# Altium schematic sheet WR_LINK.SchDoc
size A4
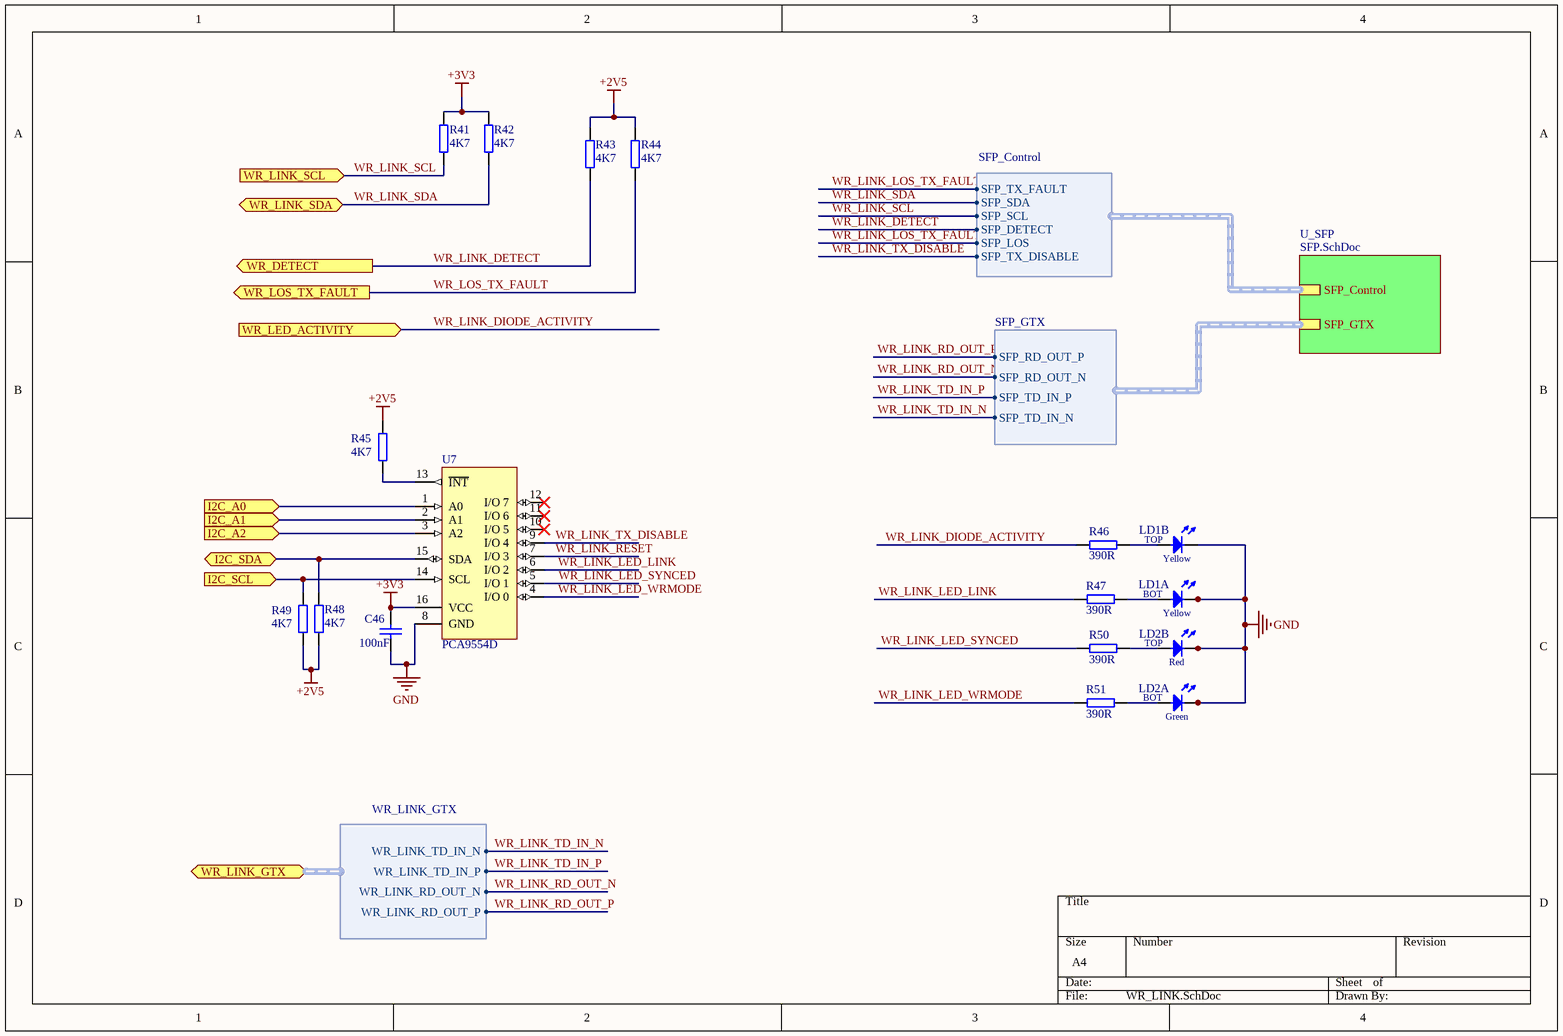
[diagram p0: WR_LINK.SchDoc]

## Parts
C46  100nF  [CC1608-0603]
LD1  Yellow/Yellow  [LED_DIALIGHT_571-0133-100F]  (value not drawn)  (parts A,B of 2)
LD2  Green/Yellow  [LED_DIALIGHT_571-0132-100F]  (value not drawn)  (parts A,B of 2)
R41  4K7  [0402]
R42  4K7  [0402]
R43  4K7  [0402]
R44  4K7  [0402]
R45  4K7  [0603]
R46  390R  [0603]
R47  390R  [0603]
R48  4K7  [0603]
R49  4K7  [0603]
R50  390R  [0603]
R51  390R  [0603]
U7  PCA9554D  [SOP65P640X110-20N]

## Sub-sheets
U_SFP = SFP.SchDoc: SFP_Control (harness SFP_Control), SFP_GTX (harness SFP_GTX)

## Ports
I2C_A0 (in), I2C_A1 (in), I2C_A2 (in), I2C_SCL (in), I2C_SDA (bidir), WR_DETECT (out), WR_LED_ACTIVITY (in), WR_LINK_GTX (harness WR_LINK_GTX), WR_LINK_SCL (in), WR_LINK_SDA (bidir), WR_LOS_TX_FAULT (out)

## Harnesses
WR_LINK_GTX: WR_LINK_TD_IN_N, WR_LINK_TD_IN_P, WR_LINK_RD_OUT_N, WR_LINK_RD_OUT_P
SFP_GTX: SFP_TD_IN_N, SFP_TD_IN_P, SFP_RD_OUT_N, SFP_RD_OUT_P
SFP_Control: SFP_DETECT, SFP_LOS, SFP_SCL, SFP_SDA, SFP_TX_FAULT, SFP_TX_DISABLE

## Nets
+2V5: R43.2 R44.2 R45.2 R48.2 R49.1
+3V3: C46.1 R41.2 R42.2 U7.16(VCC)
GND: C46.2 LD1.1(C) LD1.3(C) LD2.1(C) LD2.3(C) U7.8(GND)
I2C_A0: U7.1(A0) ; port I2C_A0
I2C_A1: U7.2(A1) ; port I2C_A1
I2C_A2: U7.3(A2) ; port I2C_A2
I2C_SCL: R49.2 U7.14(SCL) ; port I2C_SCL
I2C_SDA: R48.1 U7.15(SDA) ; port I2C_SDA
WR_LINK_DETECT: R43.1 ; port WR_DETECT, sheet U_SFP/SFP_Control.SFP_DETECT
WR_LINK_DIODE_ACTIVITY: R46.2 ; port WR_LED_ACTIVITY
WR_LINK_LED_LINK: R47.2 U7.6(I/O_2)
WR_LINK_LED_SYNCED: R50.2 U7.5(I/O_1)
WR_LINK_LED_WRMODE: R51.2 U7.4(I/O_0)
WR_LINK_LOS_TX_FAULT: sheet U_SFP/SFP_Control.SFP_LOS, sheet U_SFP/SFP_Control.SFP_TX_FAULT
WR_LINK_RD_OUT_N: port WR_LINK_GTX.WR_LINK_RD_OUT_N, sheet U_SFP/SFP_GTX.SFP_RD_OUT_N
WR_LINK_RD_OUT_P: port WR_LINK_GTX.WR_LINK_RD_OUT_P, sheet U_SFP/SFP_GTX.SFP_RD_OUT_P
WR_LINK_RESET: U7.7(I/O_3)
WR_LINK_SCL: R41.1 ; port WR_LINK_SCL, sheet U_SFP/SFP_Control.SFP_SCL
WR_LINK_SDA: R42.1 ; port WR_LINK_SDA, sheet U_SFP/SFP_Control.SFP_SDA
WR_LINK_TD_IN_N: port WR_LINK_GTX.WR_LINK_TD_IN_N, sheet U_SFP/SFP_GTX.SFP_TD_IN_N
WR_LINK_TD_IN_P: port WR_LINK_GTX.WR_LINK_TD_IN_P, sheet U_SFP/SFP_GTX.SFP_TD_IN_P
WR_LINK_TX_DISABLE: U7.9(I/O_4) ; sheet U_SFP/SFP_Control.SFP_TX_DISABLE
WR_LOS_TX_FAULT: R44.1 ; port WR_LOS_TX_FAULT
NetLD1_2: LD1.2(A) R47.1
NetLD1_4: LD1.4(A) R46.1
NetLD2_2: LD2.2(A) R51.1
NetLD2_4: LD2.4(A) R50.1
NetR45_1: R45.1 U7.13(~{INT})

Not connected (* = marked no-connect by the designer): U7 10(I/O_5)* 11(I/O_6)* 12(I/O_7)*

## Notes on the sheet
- (in symbol LED_DIALIGHT_571-0132-100F, part A) BOT; Green
- (in symbol LED_DIALIGHT_571-0132-100F, part B) TOP; Red
- (in symbol LED_DIALIGHT_571-0133-100F, part A) BOT; Yellow
- (in symbol LED_DIALIGHT_571-0133-100F, part B) TOP; Yellow

## Library data of the parts
C46 = CC0603_100NF_16V_10%_X7R: Capacitor; Manufacturer1: AVX; Manufacturer1 PN: 0603YC104KAT2A; TC: X7R; Tolerance: ±10%; Voltage: 16V; Published: 8-Jun-2000; LatestRevisionDate: 17-Jul-2002; LatestRevisionNote: Re-released for DXP Platform.; PackageReference: RAD-0.3; Publisher: Altium Limited; Distributor1: Digikey; Distributor1 PN: 478-1239-1-ND; Case: 0603; Value: 100nF
LD1 = LED_DIALIGHT_571-0133-100F: LED x2 Yellow 1C2A-BOT_3C4A-TOP; Part Description: Dual 2mm Yellow LEDs CBI® Circuit Board Indicator (With positioning pins); Table: LEDs & Displays; Part Number: LED_DIALIGHT_571-0133-100F; Component Kind: Standard; Component Type: Standard; Color: Yellow/Yellow; PackageDescription: 2x 2mm Yellow LED PCB Edge Mounting (With positioning pins) DIALIGHT 571 Serie; Manufacturer: DIALIGHT; Manufacturer Part Number: 571-0133-100F; Pin Count: 4; Mounted: Yes; Socket: No; SMD: No; ComponentHeight: 8.6mm; HelpURL: \\cern.ch\dfs\Applications\Altium\Datasheets\LED_DIALIGHT_571-0133-100F.pdf; Author: CERN DEM JLC; CreateDate: 05/11/2009; LatestRevisionDate: 17/03/2010
LD2 = LED_DIALIGHT_571-0132-100F: 2x LED  Botom Green, Top Yellow; Part Description: Dual 2mm  LEDs, Yellow Top,Green Bot, CBI® Circuit Board Indicator (With positioning pins); Table: LEDs & Displays; Part Number: LED_DIALIGHT_571-0132-100F; Component Kind: Standard; Component Type: Standard; Color: Green/Yellow; PackageDescription: 2x 2mm LED (Top: Yellow, Bot: Green) PCB Edge Mounting (With positioning pins) DIALIGHT 571 Serie; Manufacturer: DIALIGHT; Manufacturer Part Number: 571-0132-100F; Pin Count: 4; Mounted: Yes; Socket: No; SMD: No; ComponentHeight: 8.6mm; HelpURL: \\cern.ch\dfs\Applications\Altium\Datasheets\LED_DIALIGHT_571-0132-100F.pdf; Author: CERN DEM JLC; CreateDate: 05/11/2009; LatestRevisionDate: 17/03/2010
R41-R44 = R0402_4.7K_±1%_0.1W_100PPM: SMD Resistor; Manufacturer1: Panasonic; Manufacturer1 PN: ERJ-2RKF4701X; TCR: 100ppm; Power Rating: 0.1W; Tolerance: ±1%; Case: 0402; Distributor1: DigiKey; Distributor1 PN: ERJ-2RKF4701X; Value: 4K7
R45 R48 R49 = R0603_4.7K_±1%_0.1W_100PPM: SMD Resistor; Manufacturer1: Panasonic; Manufacturer1 PN: ERJ-3EKF4701V; TCR: 100ppm; Power Rating: 0.1W; Tolerance: ±1%; Case: 0603; Distributor1: DigiKey; Distributor1 PN: P4.70KHCT-ND; Value: 4K7
R46 R47 R50 R51 = R0603_390R_±1%_0.1W_100PPM: SMD Resistor; Manufacturer1: Panasonic; Manufacturer1 PN: ERJ-3EKF3900V; TCR: 100ppm; Power Rating: 0.1W; Tolerance: ±1%; Case: 0603; Distributor1: DigiKey; Distributor1 PN: P390HCT-ND; Value: 390R
U7 = PCA9554D: 8-bit I2C-bus SMBus I/O port with interrupt; Manufacturer1 PN: PCA9554ATS,118; Manufacturer1: NXP Semiconductors; Distributor1: Digikey; Distributor1 PN: 568-2024-1-ND